# Altium schematic sheet sensor_connector.SchDoc
size A4
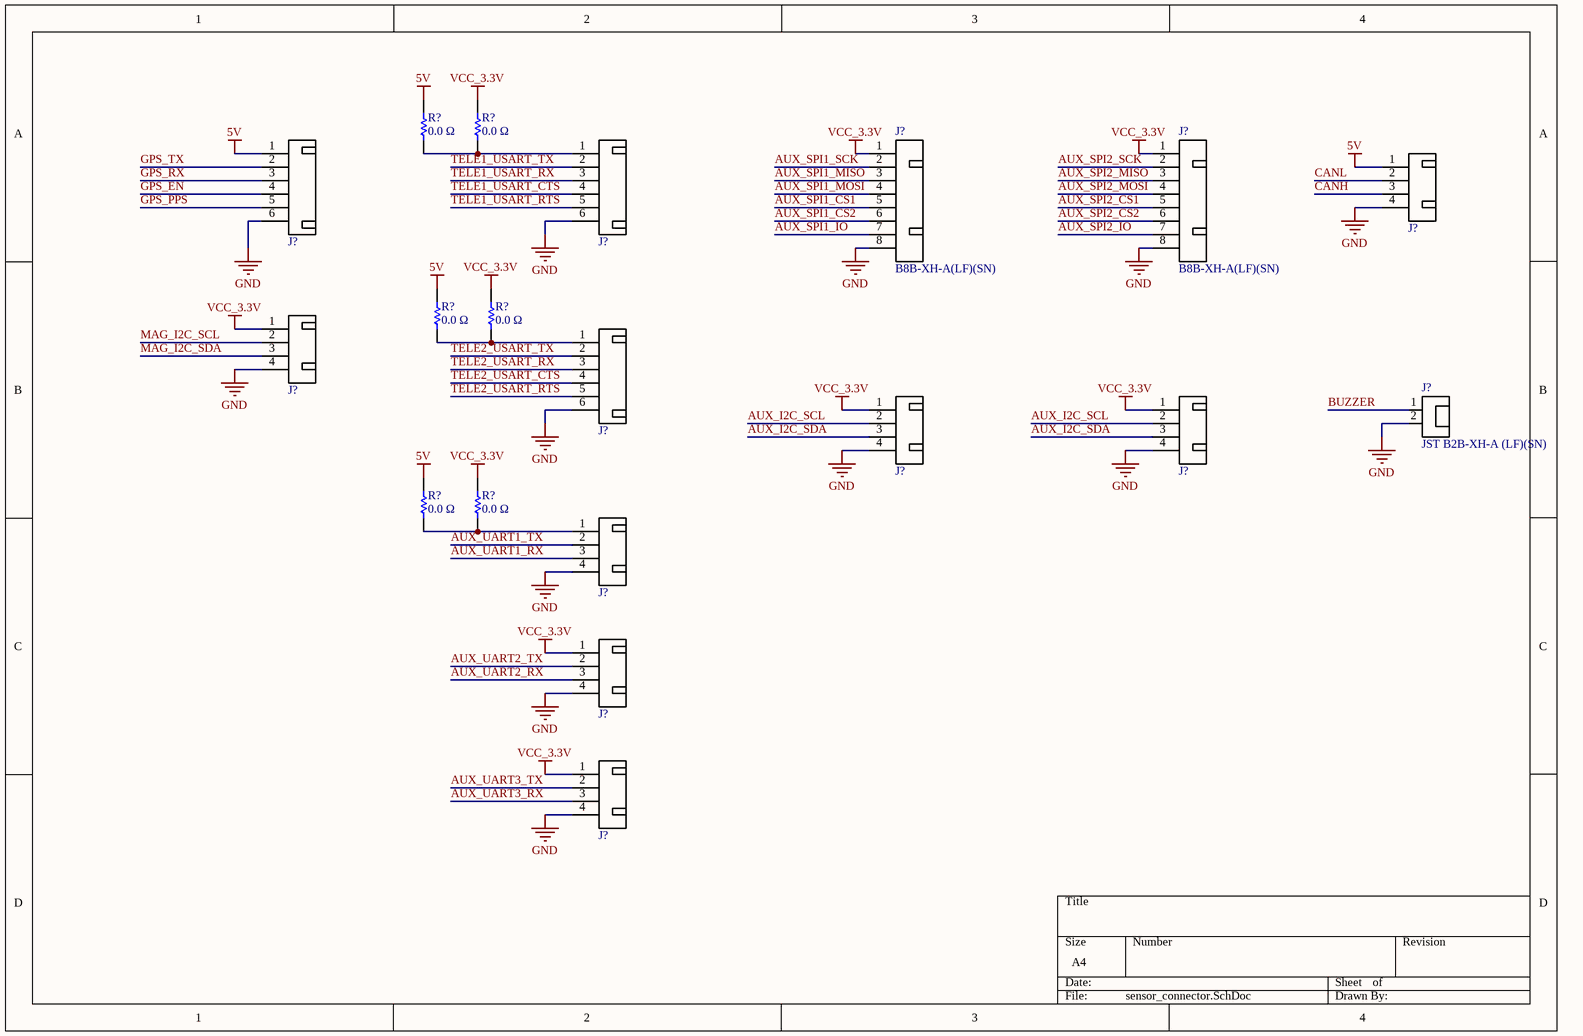
[diagram p0: sensor_connector.SchDoc]

## Parts
(Parts that share a designator on the sheet are numbered #1, #2 ... from top to bottom, then left to right.)
J?#1  JST B4B-XH-A(LF)(SN)  [PCB-rn764ziyin307yo895gf-1]  (value not drawn)
J?#2  JST B6B-XH-A(LF)(SN)  [PCB-z7tho54h7p2kc79zj16v-1]  (value not drawn)
J?#3  JST B6B-XH-A(LF)(SN)  [PCB-z7tho54h7p2kc79zj16v-1]  (value not drawn)
J?#4  Manufacturer Part Number: B8B-XH-A(LF)(SN)  [PCB-mlv55ck369se549tp0uo-1]  (hidden comment: JST B8B-XH-A(LF)(SN))
J?#5  Manufacturer Part Number: B8B-XH-A(LF)(SN)  [PCB-mlv55ck369se549tp0uo-1]  (hidden comment: JST B8B-XH-A(LF)(SN))
J?#6  JST B4B-XH-A(LF)(SN)  [PCB-rn764ziyin307yo895gf-1]  (value not drawn)
J?#7  JST B4B-XH-A(LF)(SN)  [PCB-rn764ziyin307yo895gf-1]  (value not drawn)
J?#8  JST B4B-XH-A(LF)(SN)  [PCB-rn764ziyin307yo895gf-1]  (value not drawn)
J?#9  JST B6B-XH-A(LF)(SN)  [PCB-z7tho54h7p2kc79zj16v-1]  (value not drawn)
J?#10  JST B2B-XH-A (LF)(SN)  [PCB-s8s8ac3ylnu6waak0fxh-1]
J?#11  JST B4B-XH-A(LF)(SN)  [PCB-rn764ziyin307yo895gf-1]  (value not drawn)
J?#12  JST B4B-XH-A(LF)(SN)  [PCB-rn764ziyin307yo895gf-1]  (value not drawn)
J?#13  JST B4B-XH-A(LF)(SN)  [PCB-rn764ziyin307yo895gf-1]  (value not drawn)
R?#1  0.0 Ω  [RESC1608X55X25LL10T15]
R?#2  0.0 Ω  [RESC1608X55X25LL10T15]
R?#3  0.0 Ω  [RESC1608X55X25LL10T15]
R?#4  0.0 Ω  [RESC1608X55X25LL10T15]
R?#5  0.0 Ω  [RESC1608X55X25LL10T15]
R?#6  0.0 Ω  [RESC1608X55X25LL10T15]

## Nets
5V: J?#1.1 J?#2.1 R?#1.2 R?#3.2 R?#5.2
GND: J?#1.4 J?#2.6 J?#3.6 J?#4.8 J?#5.8 J?#6.4 J?#7.4 J?#8.4 J?#9.6 J?#10.2 J?#11.4 J?#12.4 J?#13.4
VCC_3.3V: J?#4.1 J?#5.1 J?#6.1 J?#7.1 J?#8.1 J?#12.1 J?#13.1 R?#2.2 R?#4.2 R?#6.2
AUX_I2C_SCL: J?#7.2 J?#8.2
AUX_I2C_SDA: J?#7.3 J?#8.3
AUX_SPI1_CS1: J?#4.5
AUX_SPI1_CS2: J?#4.6
AUX_SPI1_IO: J?#4.7
AUX_SPI1_MISO: J?#4.3
AUX_SPI1_MOSI: J?#4.4
AUX_SPI1_SCK: J?#4.2
AUX_SPI2_CS1: J?#5.5
AUX_SPI2_CS2: J?#5.6
AUX_SPI2_IO: J?#5.7
AUX_SPI2_MISO: J?#5.3
AUX_SPI2_MOSI: J?#5.4
AUX_SPI2_SCK: J?#5.2
AUX_UART1_RX: J?#11.3
AUX_UART1_TX: J?#11.2
AUX_UART2_RX: J?#12.3
AUX_UART2_TX: J?#12.2
AUX_UART3_RX: J?#13.3
AUX_UART3_TX: J?#13.2
BUZZER: J?#10.1
CANH: J?#1.3
CANL: J?#1.2
GPS_EN: J?#2.4
GPS_PPS: J?#2.5
GPS_RX: J?#2.3
GPS_TX: J?#2.2
MAG_I2C_SCL: J?#6.2
MAG_I2C_SDA: J?#6.3
TELE1_USART_CTS: J?#3.4
TELE1_USART_RTS: J?#3.5
TELE1_USART_RX: J?#3.3
TELE1_USART_TX: J?#3.2
TELE2_USART_CTS: J?#9.4
TELE2_USART_RTS: J?#9.5
TELE2_USART_RX: J?#9.3
TELE2_USART_TX: J?#9.2
NetJ?#3_1: J?#3.1 R?#1.1 R?#2.1
NetJ?#9_1: J?#9.1 R?#3.1 R?#4.1
NetJ?#11_1: J?#11.1 R?#5.1 R?#6.1

## Library data of the parts
J?#1 J?#6-J?#8 J?#11-J?#13 = CMP-2690ef7e729af957-12: JST Shrouded Header, XH Series, Top Entry, 4 way, 2.5 mm
J?#2 J?#3 J?#9 = CMP-f3cb3ac5a78f2c0c-10: Socket; wire-board; male; XH; 2.5mm; PIN: 6; THT; 250V; 3A; -25÷85°C; Number of Contacts: 6; Lead-Free Status: Contains Lead; Manufacturer Part Number: B6B-XH-A
J?#4 J?#5 = CMP-8c2545134b9253e2-2: Connector Header, XH Series, 8 Position, 2.50mm, Through Hole, Press-Fit, Solder, Natural; Manufacturer: JST Sales America Inc.; VALUE: 8P VERT; Insulation Resistance: 1.00 G?; Voltage Rating (AC): 250 V; Gender: Male; Lead-Free Status: Lead Free; Current Rating: 3.00 A; Number of Contacts: 8; Contact Resistance: 10.0 m?; OctopartID: 8c2545134b9253e2; Mounting Style: Through Hole, Vertical; Octopart URL: https://octopart.com/b8b-xh-a%28lf%29%28sn%29-jst-3990225; Contact Plating: Tin, Tin Lead; Operating Temperature: -25.0 °C (min); RoHS: Compliant; REACH SVHC Compliance: No SVHC; Contact Material: Brass
J?#10 = CMP-a2a66bdac84f7d61-16: XH Series 2 Position 2.5 mm Pitch Through Hole Top Entry Shrouded Header; Gender: Male; Voltage Rating (AC): 250 V; Lead-Free Status: Lead Free; Insulation Resistance: 1.00 GΩ; Number of Contacts: 2; Contact Resistance: 10.0 mΩ; Current Rating: 3.00 A; Mounting Style: Through Hole, Vertical; RoHS: Compliant; Manufacturer Part Number: B2B-XH-A (LF)(SN); Octopart URL: http://octopart.com/b2b-xh-a+%28lf%29%28sn%29-jst-7753615; Contact Material: Brass; REACH SVHC Compliance: No SVHC; OctopartID: a2a66bdac84f7d61; Contact Plating: Tin
R?#1-R?#6 = CMP-3661350-4: Thick Film Resistors - SMD ZERO OHM JUMPER; Voltage Rating (DC): 50.0 V; Lead-Free Status: Lead Free; Resistance Tolerance: ±5%; Octopart Url: https://octopart.com/rc0603jr-130rl-yageo-9297262; Case/Package: 0603; OctopartID: ee3b27bc163331fc; Resistance: 0.0 Ω